# EAGLE design nanonode-xmega-mc-headers-qfp-a4 (EAGLE 5.10)
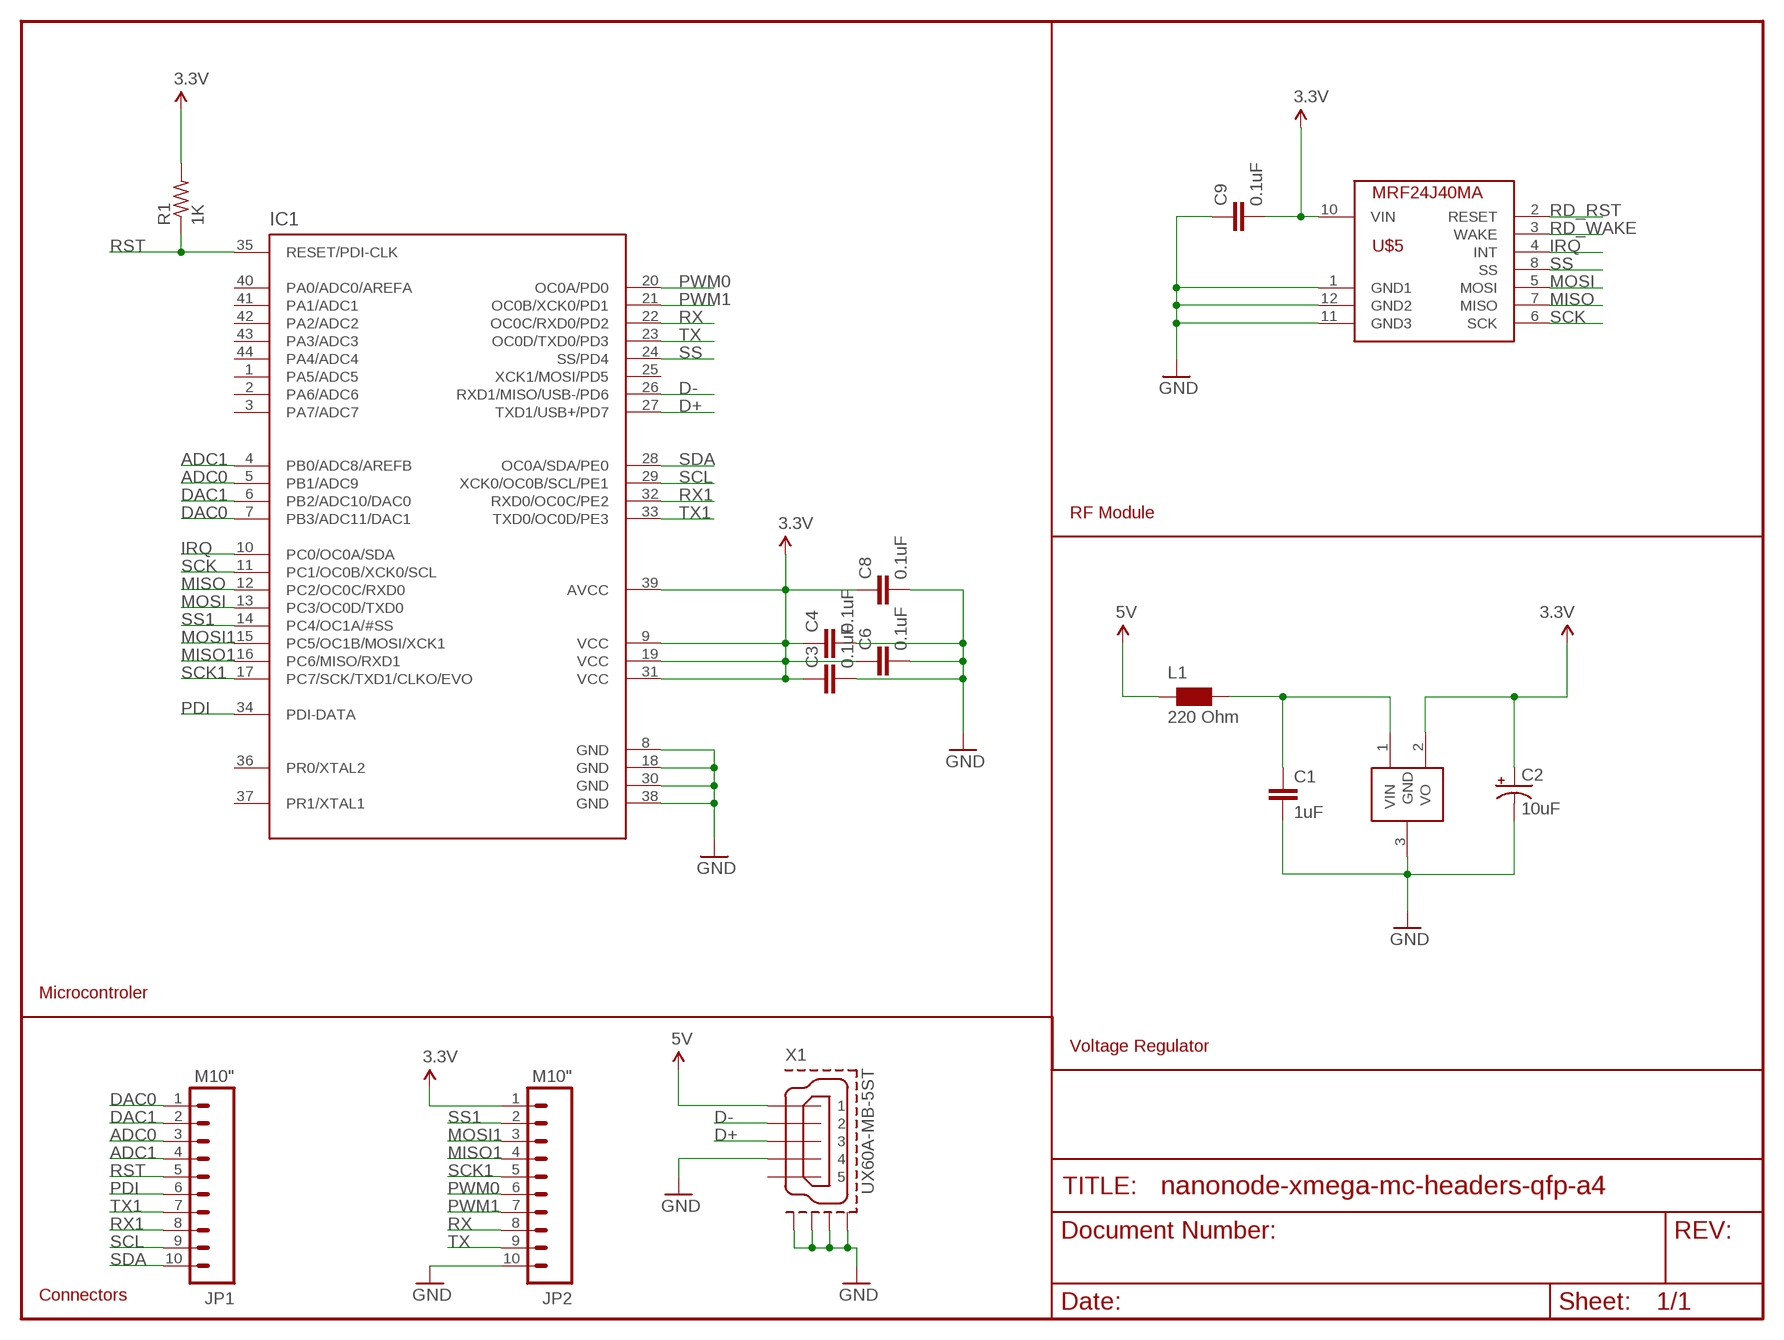
[diagram p0: schematic, sheet 1]

## Parts
C1  1uF  C-EUC0603  [C0603]
C2  10uF  CAP_POL1206  [EIA3216]
C3  0.1uF  C-EUC0603  [C0603]
C4  0.1uF  C-EUC0603  [C0603]
C6  0.1uF  C-EUC0603  [C0603]
C8  0.1uF  C-EUC0603  [C0603]
C9  0.1uF  C-EUC0603  [C0603]
IC1  ATXMEGAXXA4U  [TQFP-44]
JP1  M10"  [1X10]
JP2  M10"  [1X10]
L1  220 Ohm  WE-CBF_0603  [0603]
R1  1K  R-US_R0603  [R0603]
U2  MCP1700  [SOT23-3]
U$5  MRF24J40MA  [MRF24J40MA]
X1  UX60A-MB-5ST  MINI-USB-SHIELD-UX60A-MB-5ST  [UX60A-MB-5ST]

## Nets
3.3V: C2.A(+) C3.1 C4.1 C6.1 C8.1 C9.2 IC1.9(VCC) IC1.19(VCC) IC1.31(VCC) IC1.39(AVCC) JP2.1 U2.2(VO) U$5.10(VIN)
5V: L1.1 X1.1
ADC0: IC1.5(PB1/ADC9) JP1.3
ADC1: IC1.4(PB0/ADC8/AREFB) JP1.4
D+: IC1.27(TXD1/USB+/PD7) X1.3
D-: IC1.26(RXD1/MISO/USB-/PD6) X1.2
DAC0: IC1.7(PB3/ADC11/DAC1) JP1.1
DAC1: IC1.6(PB2/ADC10/DAC0) JP1.2
GND: C1.2 C2.C(-) C3.2 C4.2 C6.2 C8.2 C9.1 IC1.8(GND) IC1.18(GND) IC1.30(GND) IC1.38(GND) JP2.10 U2.3(GND) U$5.1(GND1) U$5.11(GND3) U$5.12(GND2) X1.4 X1.M1(GND1) X1.M2(GND2) X1.M3(GND3) X1.M4(GND4)
IRQ: IC1.10(PC0/OC0A/SDA) U$5.4(INT)
MISO: IC1.12(PC2/OC0C/RXD0) U$5.7(MISO)
MISO1: IC1.16(PC6/MISO/RXD1) JP2.4
MOSI: IC1.13(PC3/OC0D/TXD0) U$5.5(MOSI)
MOSI1: IC1.15(PC5/OC1B/MOSI/XCK1) JP2.3
N$2: R1.2 ; supply symbol labelled 3.3V
N$13: C1.1 L1.2 U2.1(VIN)
PDI: IC1.34(PDI-DATA) JP1.6
PWM0: IC1.20(OC0A/PD0) JP2.6
PWM1: IC1.21(OC0B/XCK0/PD1) JP2.7
RD_RST: U$5.2(RESET)
RD_WAKE: U$5.3(WAKE)
RST: IC1.35(RESET/PDI-CLK) JP1.5 R1.1
RX: IC1.22(OC0C/RXD0/PD2) JP2.8
RX1: IC1.32(RXD0/OC0C/PE2) JP1.8
SCK: IC1.11(PC1/OC0B/XCK0/SCL) U$5.6(SCK)
SCK1: IC1.17(PC7/SCK/TXD1/CLKO/EVO) JP2.5
SCL: IC1.29(XCK0/OC0B/SCL/PE1) JP1.9
SDA: IC1.28(OC0A/SDA/PE0) JP1.10
SS: IC1.24(SS/PD4) U$5.8(SS)
SS1: IC1.14(PC4/OC1A/#SS) JP2.2
TX: IC1.23(OC0D/TXD0/PD3) JP2.9
TX1: IC1.33(TXD0/OC0D/PE3) JP1.7
Unconnected: IC1.1(PA5/ADC5) IC1.2(PA6/ADC6) IC1.3(PA7/ADC7) IC1.25(XCK1/MOSI/PD5) IC1.36(PR0/XTAL2) IC1.37(PR1/XTAL1) IC1.40(PA0/ADC0/AREFA) IC1.41(PA1/ADC1) IC1.42(PA2/ADC2) IC1.43(PA3/ADC3) IC1.44(PA4/ADC4) X1.5

## Notes on the sheet
- RF Module
- Microcontroler
- Voltage Regulator
- Connectors

## Library data of the parts
C1 C3 C4 C6 C8 C9 = rcl:C-EU: CAPACITOR, European symbol
C2 = sparkfun:CAP_POL: Capacitor Polarized These are standard SMD and PTH capacitors. Normally 10uF, 47uF, and 100uF in electrolytic and tantalum varieties. Always verify the external diameter of the through hole cap, it varies with capacity, voltage, and manufacturer. The EIA devices should be standard.
IC1 = nonolith:ATXMEGAXXA4U: ATXMEGA A4U Series (XMEGA+USB)
JP1 JP2 = sparkfun:M10: Header 10 Standard 10-pin 0.1" header. Use with straight break away headers (SKU : PRT-00116), right angle break away headers (PRT-00553), swiss pins (PRT-00743), machine pins (PRT-00117), and female headers (PRT-00115).
L1 = wuerth-elektronik:WE-CBF: SMD EMI Suppression Ferrite Beads - excellent anti-EMI properties - low DCR - impedances till 3000 ohms - rated current up to 6 A
R1 = rcl:R-US_: RESISTOR, American symbol
U2 = nonolith:MCP1700: Voltage regulator
U$5 = custom:MRF24J40MA
X1 = usb_con-update:MINI-USB-SHIELD-: MINI USB Connector Source: http://www.hirose.co.jp/cataloge_hp/e24000019.pdf

## Board
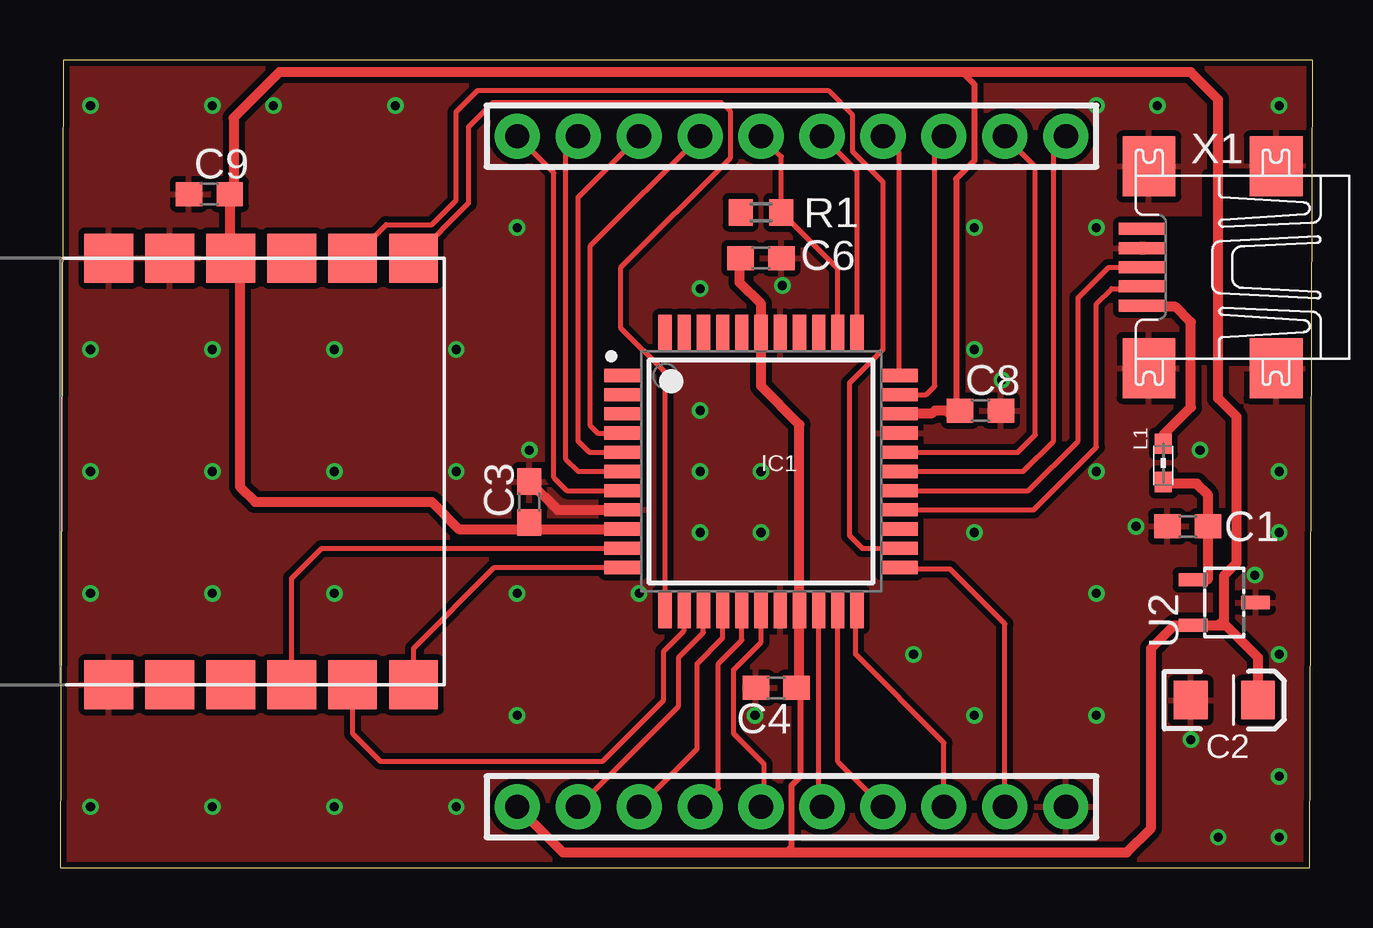
[diagram p1: board, top side]
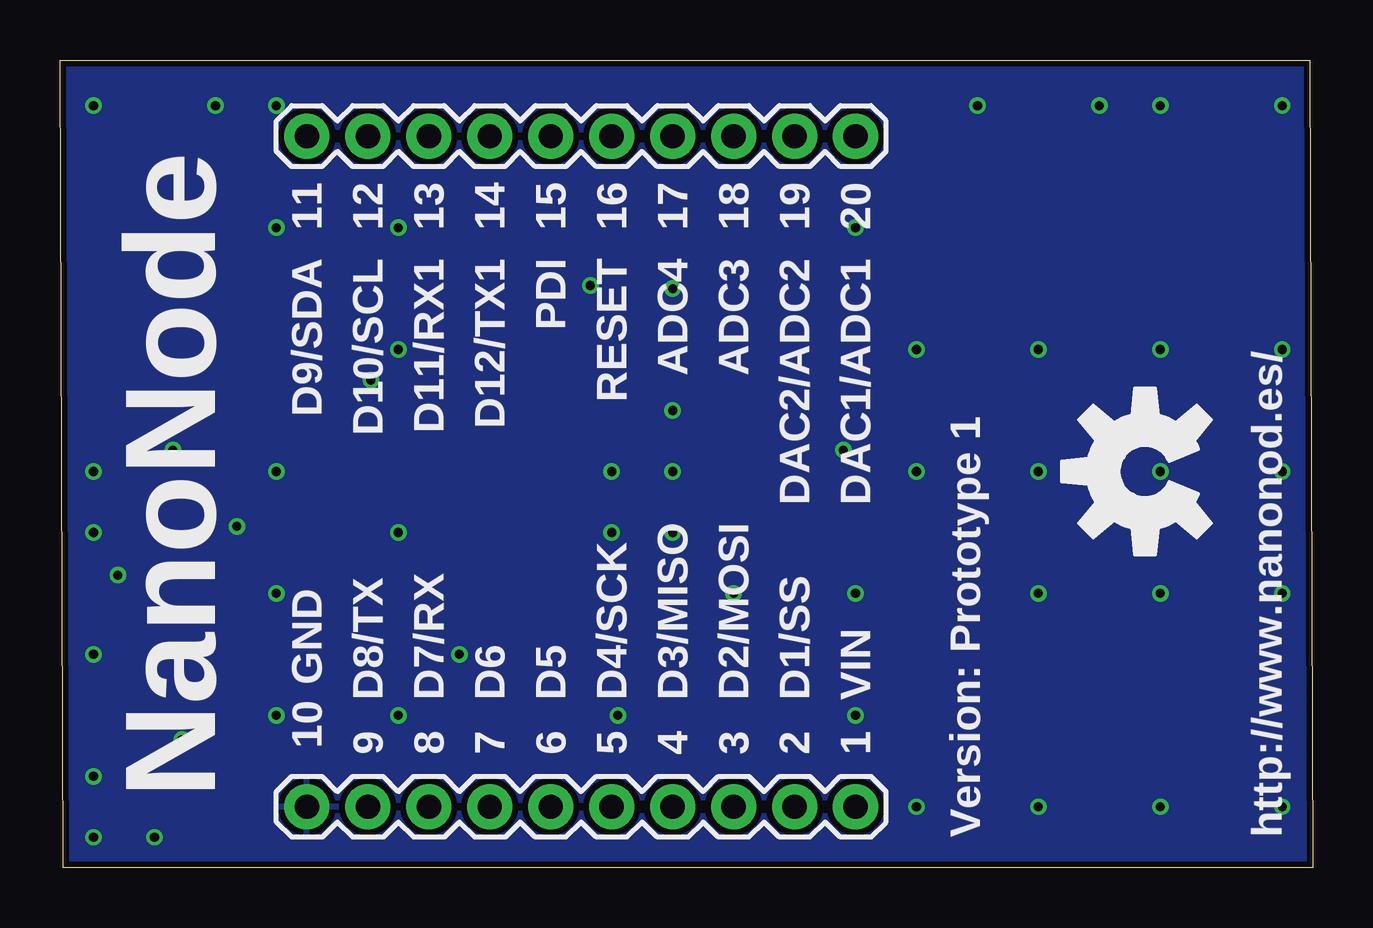
[diagram p2: board, bottom side, seen from below]

Size 52.2 x 33.66 mm. Coordinates in mm from the lower left corner, seen from the top.
Outline: 52.2,33.66 0.13,33.66 0,0 52.07,0 52.2,33.66
Copper layers (1*16): Top 0.035mm / dielectric 1.5mm / Bottom 0.035mm
Design rules "Fusion_eagle_rule_v1.1": minimum track width 6mil, minimum drill 12mil, track to track 6mil, track to pad 6mil, pad to pad 6mil, via to via 6mil, smd to smd 0mil, copper to edge 10mil, drill to drill 10mil, minimum pad ring 10mil, minimum via ring 6mil, stop-mask expansion 2mil, vias tented up to drill 100mil, thermal gap 10mil

### Footprints (pad centres in the part's own frame; a part is rotated, then mirrored left to right if it is on the bottom)
C0603 = smd 1.1 x 1: 1 -0.85,0; 2 0.85,0
EIA3216 = smd 1.4 x 1.6: A 1.4,0; C -1.4,0
TQFP-44 = smd 1.55 x 0.55: 1 -5.75,4; 2 -5.75,3.2; 3 -5.75,2.4; 4 -5.75,1.6; 5 -5.75,0.8; 6 -5.75,0; 7 -5.75,-0.8; 8 -5.75,-1.6; 9 -5.75,-2.4; 10 -5.75,-3.2; 11 -5.75,-4; 23 5.75,-4; 24 5.75,-3.2; 25 5.75,-2.4; 26 5.75,-1.6; 27 5.75,-0.8; 28 5.75,0; 29 5.75,0.8; 30 5.75,1.6; 31 5.75,2.4; 32 5.75,3.2; 33 5.75,4 | smd 0.55 x 1.55: 12 -4,-5.75; 13 -3.2,-5.75; 14 -2.4,-5.75; 15 -1.6,-5.75; 16 -0.8,-5.75; 17 0,-5.75; 18 0.8,-5.75; 19 1.6,-5.75; 20 2.4,-5.75; 21 3.2,-5.75; 22 4,-5.75; 34 4,5.75; 35 3.2,5.75; 36 2.4,5.75; 37 1.6,5.75; 38 0.8,5.75; 39 0,5.75; 40 -0.8,5.75; 41 -1.6,5.75; 42 -2.4,5.75; 43 -3.2,5.75; 44 -4,5.75
1X10 = drill 1.016 pad 1.88 round: 1 0,0; 2 2.54,0; 3 5.08,0; 4 7.62,0; 5 10.16,0; 6 12.7,0; 7 15.24,0; 8 17.78,0; 9 20.32,0; 10 22.86,0
0603 = smd 0.85 x 0.7: 1 -0.9,0; 2 0.7,0
R0603 = smd 1 x 1.1: 1 -0.85,0; 2 0.85,0
SOT23-3 = smd 0.55 x 1.2: 1 0.95,1.3; 2 -0.95,1.3; 3 0,-1.3
MRF24J40MA = smd 2.032 x 2.032: 1 -13.97,0; 2 -11.43,0; 3 -8.89,0; 4 -6.35,0; 5 -3.81,0; 6 -1.27,0; 7 -1.27,17.78; 8 -3.81,17.78; 9 -6.35,17.78; 10 -8.89,17.78; 11 -11.43,17.78; 12 -13.97,17.78
UX60A-MB-5ST = smd 2 x 0.5: 1 2.25,1.6; 2 2.25,0.8; 3 2.25,0; 4 2.25,-0.8; 5 2.25,-1.6 | smd 2.2 x 2.5: M1 -3.3,-4.2; M2 -3.3,4.2; M3 2,4.2; M4 2,-4.2

### Placement (x,y rotation side)
C1  46.99,14.22 180 top
C2  48.51,6.99 0 top
C3  19.56,15.24 90 top
C4  29.84,7.49 180 top
C6  29.21,25.4 0 top
C8  38.35,19.05 0 top
C9  6.22,28.07 0 top
IC1  29.21,16.51 0 top
JP1  19.05,30.48 180 bottom
JP2  19.05,2.54 180 bottom
L1  45.97,16.76 270 top
R1  29.21,27.3 180 top
U2  48.51,11.05 90 top
U$1  [OSHW-LOGO-L]  6.99,16.51 90 bottom
U$5  16,7.62 0 top
X1  47.37,25.02 180 top

### Tracks (layer width: path | path; a pad name or v marks a point on that pad's centre or on a via)
3.3V
  Top 0.254: 37.34,18.8 37.34,28.7 38.1,29.46 38.1,32.64 37.59,33.15 | 7.07,25.44 U$5.10 | 30.86,7.49 30.86,3.81 30.48,3.43 30.48,0.89 30.23,0.64
  Top 0.406: 30.81,7.61 IC1.19 30.81,18.47 29.21,20.07 IC1.39 29.21,23.5 28.32,24.38 28.32,25.36 C6.1 | IC1.31 34.97,18.92 36.32,18.92 36.45,19.05 36.96,19.05 | 36.96,19.05 C8.1 | 37.34,18.8 37.21,18.8 36.96,19.05 | 19.84,14.11 IC1.9 | 19.84,14.11 C3.1 | 30.81,7.61 C4.1 | 7.07,25.44 C9.2 7.11,28.07 7.24,28.19 7.24,31.24 9.14,33.15 37.59,33.15 47.12,33.15 48.26,32 48.26,19.56 49.02,18.8 49.02,12.7 48.51,12.19 48.51,10.16 48.32,10.16 48.26,10.1 | 19.84,14.11 16.62,14.11 15.49,15.24 8.13,15.24 7.49,15.88 7.49,25.02 U$5.10 | 48.26,10.1 U2.2 46.42,10.1 45.47,9.14 45.47,1.65 44.45,0.64 30.23,0.64 20.95,0.64 JP2.1 | 48.26,10.1 48.58,10.1 49.91,8.76 C2.A | 30.81,7.61 30.81,7.54 30.86,7.49
5V
  Top 0.406: L1.1 45.97,18.03 47.12,19.18 47.12,22.73 46.48,23.37 45.17,23.37 X1.1
ADC0
  Top 0.203: IC1.5 22.06,17.31 21.59,17.78 21.59,27.94 JP1.3
ADC1
  Top 0.203: IC1.4 22.4,18.11 22.1,18.41 22.1,25.91 JP1.4
D+
  Top 0.203: IC1.27 40.35,15.71 42.42,17.78 42.42,23.75 43.69,25.02 X1.3
D-
  Top 0.203: IC1.26 40.56,14.91 43.18,17.53 43.18,23.5 43.81,24.13 45.03,24.13 X1.2
DAC0
  Top 0.203: IC1.7 21.12,15.71 20.57,16.26 20.57,28.96 JP1.1
DAC1
  Top 0.203: IC1.6 21.59,16.51 21.08,17.02 21.08,29.97 JP1.2
GND  (via drill 0.38)
  Top 0.406: IC1.8 20.74,14.91 C3.2
  other vias: 1.27,21.59 6.35,21.59 11.43,21.59 1.27,16.51 6.35,16.51 11.43,16.51 1.27,11.43 6.35,11.43 49.78,12.19 47.5,17.4 1.27,31.75 6.35,31.75 1.27,2.54 6.35,2.54 11.43,2.54 16.51,2.54 50.8,31.75 11.43,11.43 8.89,31.75 13.97,31.75 16.51,21.59 16.51,16.51 19.56,17.4 19.05,26.67 26.67,24.13 19.05,11.43 24.13,11.43 19.05,6.35 26.67,19.05 26.67,16.51 26.67,13.97 29.21,13.97 29.21,16.51 38.1,13.97 38.1,6.35 43.18,16.51 43.18,11.43 43.18,6.35 50.8,3.81 48.26,1.27 50.8,1.27 50.8,8.89 50.8,13.97 50.8,16.51 38.1,21.59 38.1,26.67 43.18,26.67 43.18,31.75 45.72,31.75 35.56,8.89 44.83,14.22 47.12,5.33 28.96,6.35 39.24,20.32 30.1,24.26
  pour Top (isolate 0.254): 52.07,33.66 0,33.66 0,0 52.07,0
  pour Bottom (isolate 0.254): 52.07,33.66 0,33.66 0,0 52.07,0
IRQ
  Top 0.203: IC1.10 10.9,13.31 9.65,12.06 U$5.4
MISO
  Top 0.203: IC1.12 25.21,20.64 23.37,22.48 23.37,25.02 27.94,29.59 27.94,31.5 27.56,31.88 18.03,31.88 17.02,30.86 17.02,27.69 U$5.7
MISO1
  Top 0.203: IC1.16 28.41,9.49 27.43,8.51 27.43,3.3 JP2.4
MOSI
  Top 0.203: IC1.13 26.01,9.88 25.15,9.02 25.15,6.99 22.61,4.45 13.34,4.45 12.19,5.59 U$5.5
MOSI1
  Top 0.203: IC1.15 27.61,9.58 26.54,8.51 26.54,4.95 JP2.3
N$13
  Top 0.406: U2.1 47.81,12 47.84,12.03 C1.1 47.84,15.53 47.37,16 46.04,16 L1.2
PDI
  Top 0.203: IC1.34 33.21,29.02 JP1.6
PWM0
  Top 0.203: IC1.20 31.61,2.68 JP2.6
PWM1
  Top 0.203: IC1.21 32.41,4.42 JP2.7
RST
  Top 0.203: IC1.35 32.41,24.95 R1.1 30.06,29.63 JP1.5
RX
  Top 0.203: JP2.8 36.83,5.21 33.15,8.89 33.15,10.7 IC1.22
RX1
  Top 0.203: IC1.32 36.09,19.71 36.45,20.07 36.45,30.1 JP1.8
SCK
  Top 0.203: 14.99,7.37 U$5.6 14.73,9.14 18.1,12.51 IC1.11
SCK1
  Top 0.203: IC1.17 29.21,9.4 28.07,8.26 28.07,5.59 29.34,4.32 29.34,2.67 JP2.5
SCL
  Top 0.203: IC1.29 39.92,17.31 40.64,18.03 40.64,29.21 JP1.9
SDA
  Top 0.203: IC1.28 40.13,16.51 41.4,17.78 41.4,29.97 JP1.10
SS
  Top 0.203: IC1.24 33.43,13.31 32.89,13.84 32.89,20.19 34.29,21.59 34.29,28.57 33.02,29.84 33.02,31.37 32,32.38 17.4,32.38 16.51,31.5 16.51,27.81 15.49,26.8 13.59,26.8 U$5.8
SS1
  Top 0.203: IC1.14 26.81,9.79 25.78,8.76 25.78,6.73 JP2.2
TX
  Top 0.203: JP2.9 39.37,10.16 37.08,12.45 35.02,12.45 IC1.23
TX1
  Top 0.203: IC1.33 34.96,29.81 JP1.7

### Text on the board
bPlace: 20 | 19 | 18 | 17 | 16 | 15 | 14 | 13 | 12 | 11 | DAC1/ADC1 | DAC2/ADC2 | ADC3 | ADC4 | RESET | PDI | D12/TX1 | D11/RX1 | D10/SCL | D9/SDA | GND | VIN | D1/SS | D2/MOSI | D3/MISO | D4/SCK | D5 | D6 | D7/RX | D8/TX | 10 | 1 | 2 | 3 | 4 | 5 | 6 | 7 | 8 | 9 | NanoNode | http://www.nanonod.es/ | Version: Prototype 1